# EAGLE design syma-wireless-charger (EAGLE 7.5.0)
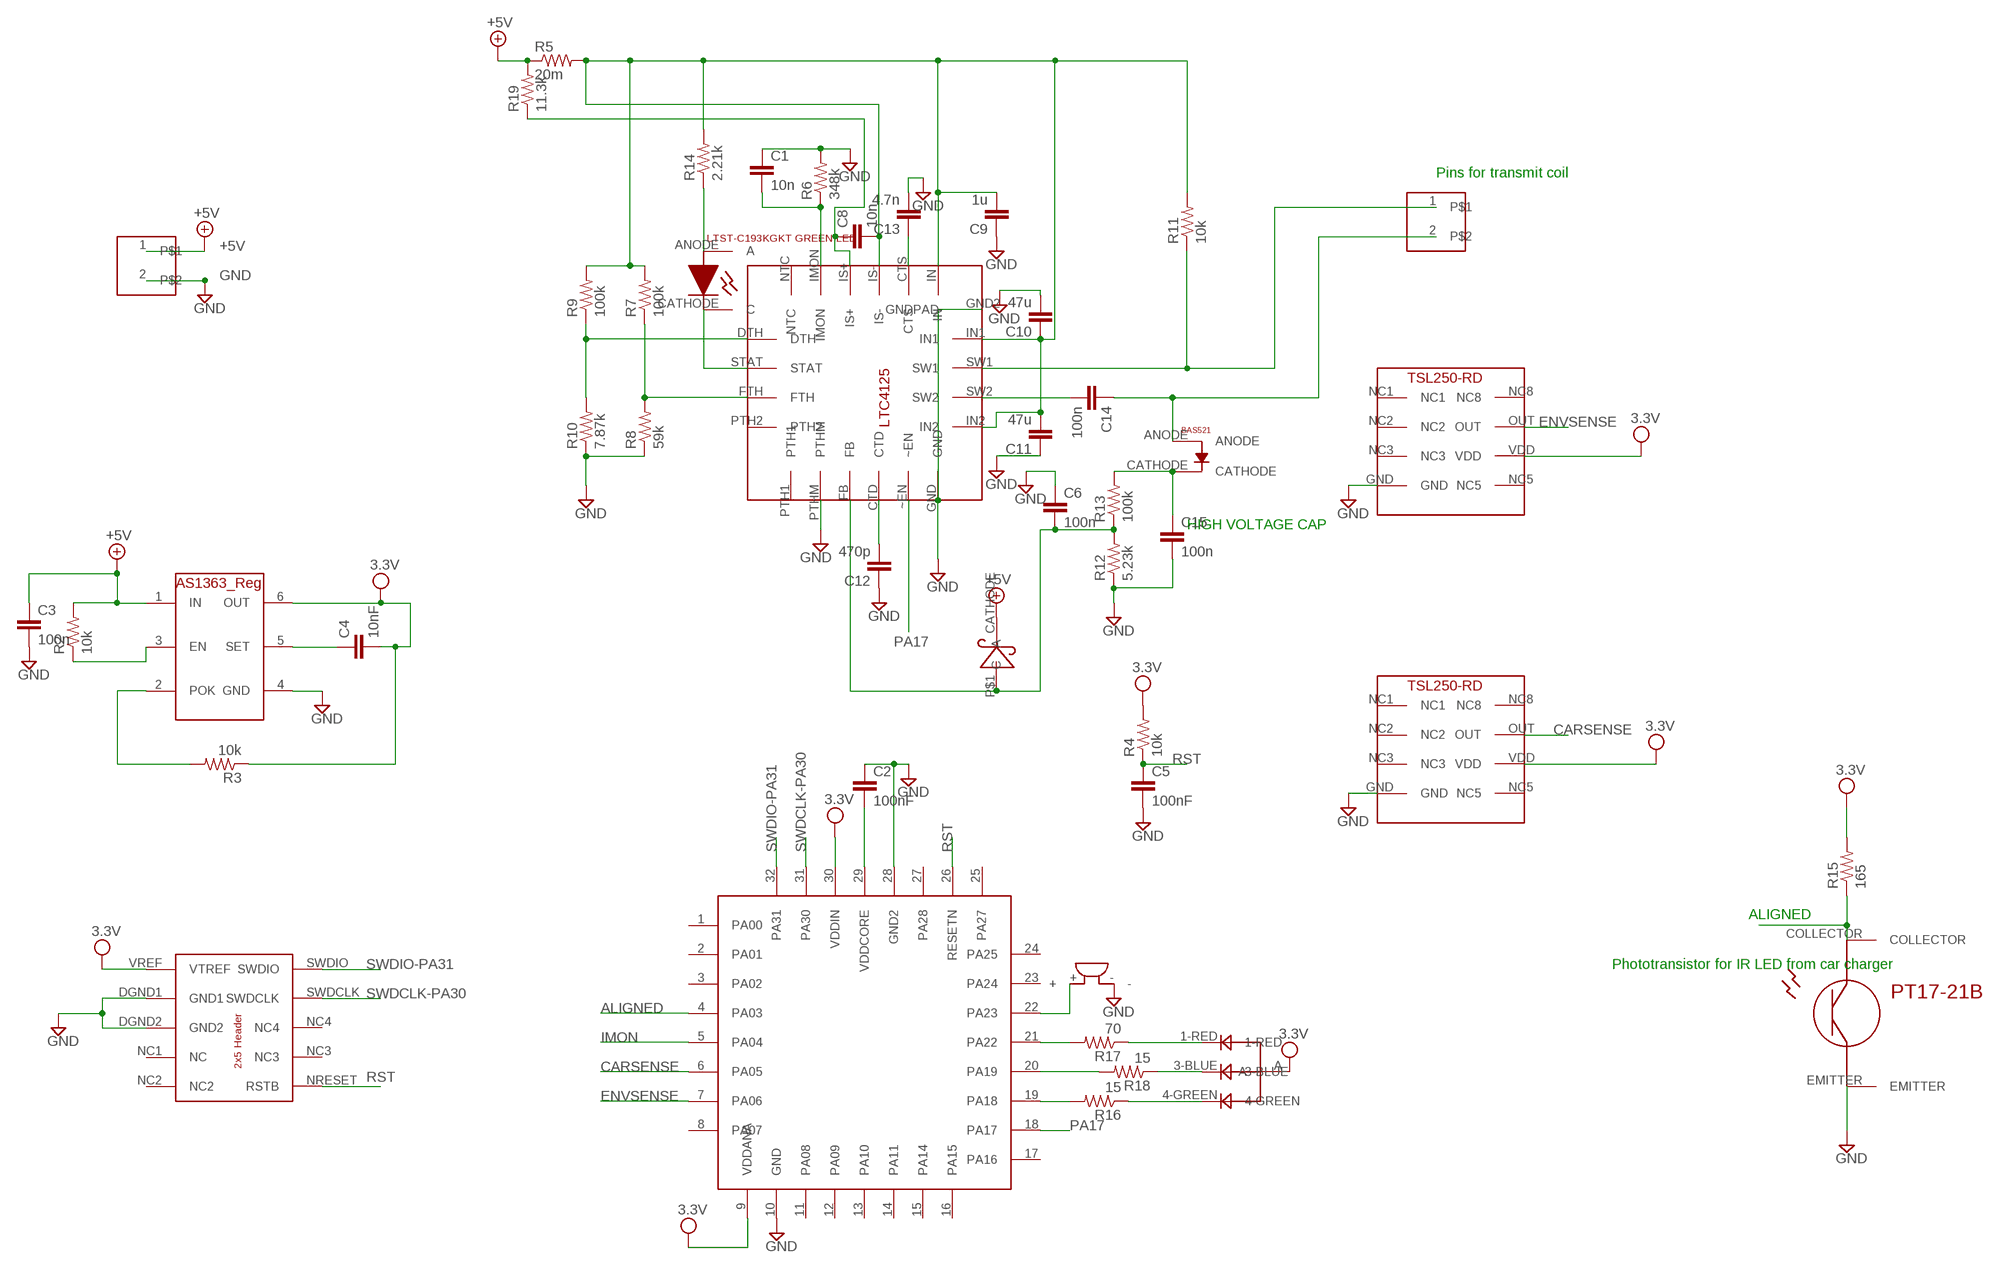
[diagram p0: schematic, sheet 1]

## Parts
C1  10n  C-EUC0805  [C0805]
C2  100nF  C-EUC0805K  [C0805K]
C3  100n  C-EUC0805K  [C0805K]
C4  10nF  C-EUC0805K  [C0805K]
C5  100nF  C-EUC0805K  [C0805K]
C6  100n  C-EUC0805  [C0805]
C8  10n  C-EUC0805  [C0805]
C9  1u  C-EUC0805  [C0805]
C10  47u  C-EUC0805  [C0805]
C11  47u  C-EUC0805  [C0805]
C12  470p  C-EUC0805  [C0805]
C13  4.7n  C-EUC0805  [C0805]
C14  100n  C-EUC1206  [C1206]
C15  100n  C-EUC0603  [C0603]
DBG1  DEBUGHEAD  [DEBUGHEAD]
R2  10k  R-US_R0805  [R0805]
R3  10k  R-US_R0805  [R0805]
R4  10k  R-US_R0805  [R0805]
R5  20m  R-US_R0805  [R0805]
R6  348k  R-US_R0805  [R0805]
R7  100k  R-US_R0805  [R0805]
R8  59k  R-US_R0805  [R0805]
R9  100k  R-US_R0805  [R0805]
R10  7.87k  R-US_R0805  [R0805]
R11  10k  R-US_R0805  [R0805]
R12  5.23k  R-US_R0805  [R0805]
R13  100k  R-US_R0805  [R0805]
R14  2.21k  R-US_R0805  [R0805]
R15  165  R-US_R0805  [R0805]
R16  15  R-US_R0805  [R0805]
R17  70  R-US_R0805  [R0805]
R18  15  R-US_R0805  [R0805]
R19  11.3k  R-US_R0805  [R0805]
U1  SAMD21E  [TQFP32-08]
U2  3.3V_AS1363  [SOT23-6]
U$1  LTC4125  [LTC1945-QFN]
U$2  BAS521  [BAS521-V-DIODE]
U$3  1X02  [1X02]
U$4  RGBLED  [RGBLED]
U$5  BUZZER  [BUZZER]
U$6  TSL250-RD  [TSL250-RD]
U$7  TSL250-RD  [TSL250-RD]
U$8  SCHTKYDIODE-523  [SOD-523]
U$9  LTST-C193KGKT_GREEN-LED  [LTST-C193KGKT_GREEN-LED]
U$10  PT17-21B_PHOTOTRANSISTOR  [PT17-21B_PHOTOTRANSISTOR]
U$11  1X02  [1X02]

## Nets
+5V: C3.1 R2.2 R5.1 R19.2 U2.1(IN) U$3.1 U$8.CATHODE(C)
ALIGNED: R15.1 U1.4(PA03) U$10.COLLECTOR
CARSENSE: U1.6(PA05) U$6.OUT
ENVSENSE: U1.7(PA06) U$7.OUT
GND: C1.1 C2.1 C3.2 C5.2 C6.1 C9.1 C10.2 C11.1 C12.1 C13.2 C15.2 DBG1.DGND1(GND1) DBG1.DGND2(GND2) R6.2 R8.1 R10.1 R12.1 U1.10(GND) U1.28(GND2) U2.4(GND) U$1.GND U$1.GND2(GNDPAD) U$1.PTHM U$3.2 U$5.- U$6.GND U$7.GND U$10.EMITTER
IMON: C1.2 R6.1 U1.5(PA04) U$1.IMON
N$1: C2.2 U1.29(VDDCORE)
N$2: R3.2 U2.2(POK)
N$3: R2.1 U2.3(EN)
N$4: R9.1 R10.2 U$1.DTH
N$5: C4.1 U2.5(SET)
N$6: R7.1 R8.2 U$1.FTH
N$7: R11.1 U$1.SW1 U$11.1
N$9: C6.2 R12.2 R13.1 U$1.FB U$8.P$1(A)
N$10: C15.1 R13.2 U$2.CATHODE
N$11: R14.1 U$9.ANODE(A)
N$12: C14.1 U$2.ANODE U$11.2
N$13: R17.2 U1.21(PA22)
N$14: R18.2 U1.20(PA19)
N$15: R16.2 U1.19(PA18)
N$16: R16.1 U$4.4-GREEN
N$17: R18.1 U$4.3-BLUE
N$18: R17.1 U$4.1-RED
N$19: U1.22(PA23) U$5.+
N$20: C8.2 C9.2 C10.1 C11.2 R5.2 R7.2 R9.2 R11.2 R14.2 U$1.IN U$1.IN1 U$1.IN2 U$1.IS-
N$21: C8.1 R19.1 U$1.IS+
N$22: C14.2 U$1.SW2
N$23: U$1.STAT U$9.CATHODE(C)
N$24: C12.2 U$1.CTD
N$25: C13.1 U$1.CTS
PA17: U1.18(PA17) U$1.~EN
RST: C5.1 DBG1.NRESET(RSTB) R4.1 U1.26(RESETN)
SWDCLK-PA30: DBG1.SWDCLK U1.31(PA30)
SWDIO-PA31: DBG1.SWDIO U1.32(PA31)
VDD: C4.2 DBG1.VREF(VTREF) R3.1 R4.2 R15.2 U1.9(VDDANA) U1.30(VDDIN) U2.6(OUT) U$4.A U$6.VDD U$7.VDD ; supply symbol labelled 3.3V
Unconnected: DBG1.NC1(NC) DBG1.NC2 DBG1.NC3 DBG1.NC4 U1.1(PA00) U1.2(PA01) U1.3(PA02) U1.8(PA07) U1.11(PA08) U1.12(PA09) U1.13(PA10) U1.14(PA11) U1.15(PA14) U1.16(PA15) U1.17(PA16) U1.23(PA24) U1.24(PA25) U1.25(PA27) U1.27(PA28) U$1.NTC U$1.PTH1 U$1.PTH2 U$6.NC1 U$6.NC2 U$6.NC3 U$6.NC5 U$6.NC8 U$7.NC1 U$7.NC2 U$7.NC3 U$7.NC5 U$7.NC8

## Notes on the sheet
- Pins for transmit coil
- HIGH VOLTAGE CAP
- ALIGNED
- Phototransistor for IR LED from car charger

## Library data of the parts
C1 C6 C8-C14 = rcl:C-EU: CAPACITOR, European symbol
C2-C5 C15 = resistor:C-EU: CAPACITOR, European symbol
DBG1 = foe-scale:DEBUGHEAD
R2-R4 R15-R18 = resistor:R-US_: RESISTOR, American symbol
R5-R14 R19 = rcl:R-US_: RESISTOR, American symbol
U1 = foe-scale:SAMD21E
U2 = foe-scale:3.3V_AS1363
U$1 = foe-scale:LTC4125
U$2 = foe-scale:BAS521
U$3 U$11 = foe-scale:1X02
U$4 = foe-scale:RGBLED
U$5 = foe-scale:BUZZER
U$6 U$7 = foe-scale:TSL250-RD
U$8 = foe-scale:SCHTKYDIODE-523
U$9 = foe-scale:LTST-C193KGKT_GREEN-LED
U$10 = foe-scale:PT17-21B_PHOTOTRANSISTOR

## Board
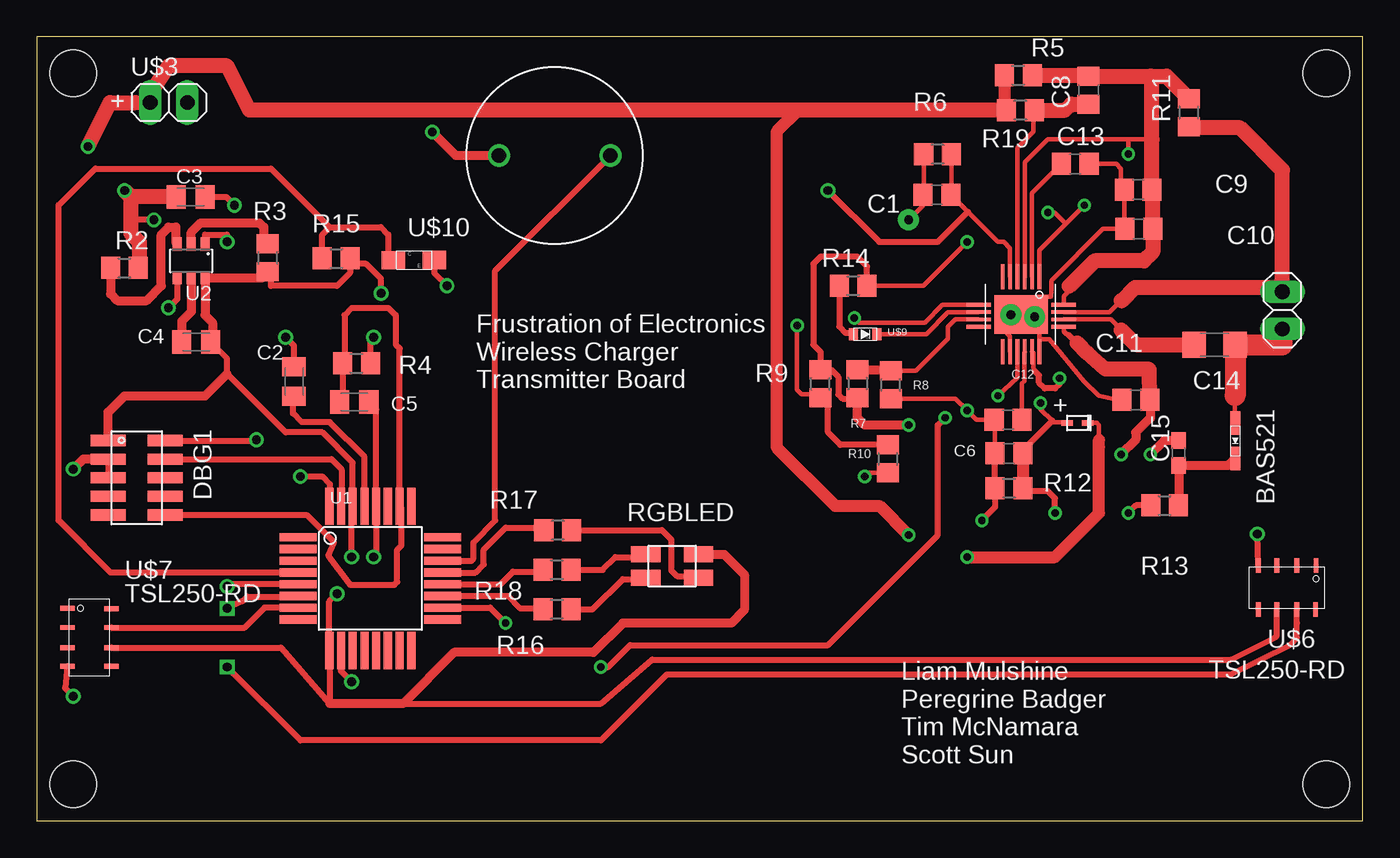
[diagram p1: board, top side]
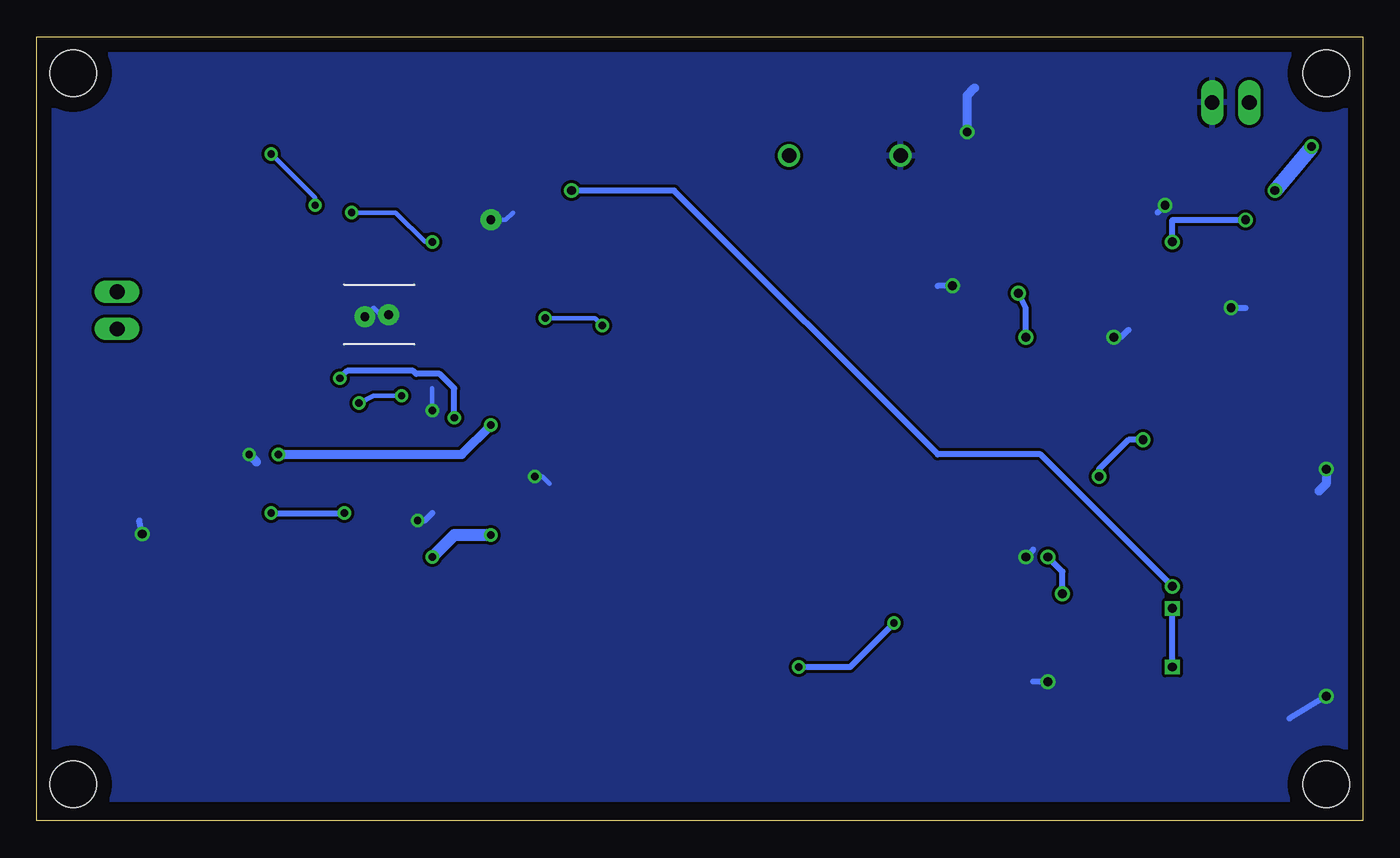
[diagram p2: board, bottom side, seen from below]

Size 90.5 x 53.5 mm. Coordinates in mm from the lower left corner, seen from the top.
Outline: 0,0 90.5,0 90.5,53.5 0,53.5 0,0
Copper layers (1*16): Top 0.035mm / dielectric 1.5mm / Bottom 0.035mm
Design rules "default": minimum track width 10mil, minimum drill 24mil, track to track 8mil, track to pad 8mil, pad to pad 8mil, via to via 8mil, smd to smd 8mil, copper to edge 40mil, drill to drill 8mil, minimum pad ring 10mil, minimum via ring 8mil, stop-mask expansion 4mil, vias tented up to drill 0mil, thermal gap 10mil
Holes 3.2 mm at 88,51 88,2.5 2.5,2.5 2.5,51

### Footprints (pad centres in the part's own frame; a part is rotated, then mirrored left to right if it is on the bottom)
C0805 = smd 1.3 x 1.5: 1 -0.95,0; 2 0.95,0
C0805K = smd 1.3 x 1.6: 1 -1,0; 2 1,0
C1206 = smd 1.6 x 1.8: 1 -1.4,0; 2 1.4,0
C0603 = smd 1.1 x 1: 1 -0.85,0; 2 0.85,0
DEBUGHEAD = smd 0.76 x 2.4: DGND1 1.27,-3.9; DGND2 2.54,-3.9; NC1 3.81,-3.9; NC2 5.08,-3.9; NC3 3.81,0; NC4 2.54,0; NRESET 5.08,0; SWDCLK 1.27,0; SWDIO 0,0; VREF 0,-3.9
R0805 = smd 1.3 x 1.5: 1 -0.95,0; 2 0.95,0
TQFP32-08 = smd 2.54 x 0.559: 1 -4.928,2.8; 2 -4.928,2; 3 -4.928,1.2; 4 -4.928,0.4; 5 -4.928,-0.4; 6 -4.928,-1.2; 7 -4.928,-2; 8 -4.928,-2.8; 17 4.928,-2.8; 18 4.928,-2; 19 4.928,-1.2; 20 4.928,-0.4; 21 4.928,0.4; 22 4.928,1.2; 23 4.928,2; 24 4.928,2.8 | smd 0.559 x 2.54: 9 -2.8,-4.928; 10 -2,-4.928; 11 -1.2,-4.928; 12 -0.4,-4.928; 13 0.4,-4.928; 14 1.2,-4.928; 15 2,-4.928; 16 2.8,-4.928; 25 2.8,4.928; 26 2,4.928; 27 1.2,4.928; 28 0.4,4.928; 29 -0.4,4.928; 30 -1.2,4.928; 31 -2,4.928; 32 -2.8,4.928
SOT23-6 = smd 0.6 x 0.9: 1 -0.95,-1.15; 2 0,-1.15; 3 0.95,-1.15; 4 0.95,1.15; 5 0,1.15; 6 -0.95,1.15
LTC1945-QFN = smd 0.25 x 1.7: CTD 1,4.6; CTS 0.5,-0.5; FB 1.5,4.6; GND 0,4.6; IMON 2,-0.5; IN 0,-0.5; IS+ 1.5,-0.5; IS- 1,-0.5; NTC 2.5,-0.5; PTH1 2.5,4.6; PTHM 2,4.6; ~EN 0.5,4.6 | smd 1.7 x 0.25: DTH 4.15,1.4; FTH 4.15,2.4; IN1 -1.65,1.4; IN2 -1.65,2.9; PTH2 4.15,2.9; STAT 4.15,1.9; SW1 -1.65,1.9; SW2 -1.65,2.4 | smd 3.65 x 2.65: GND2 1.249,2.059
BAS521-V-DIODE = smd 1.6 x 0.7: ANODE -1.211,0; CATHODE 1.186,0
1X02 = drill 1.016 long: 1 -1.27,0; 2 1.27,0
RGBLED = smd 2 x 1.1: 1-RED 0,0; 3-BLUE 3.6,-1.6; 4-GREEN 3.6,0; A 0,-1.6
BUZZER = drill 1: + 0,7.6; - 0,0
TSL250-RD = smd 1 x 0.33: GND -1.5,-1.955; NC1 -1.5,1.995; NC2 -1.5,0.685; NC3 -1.5,-0.685; NC5 1.5,-1.955; NC8 1.5,1.955; OUT 1.5,0.685; VDD 1.5,-0.685
SOD-523 = smd 0.8 x 0.4: CATHODE 1.2,0; P$1 -0.2,0
LTST-C193KGKT_GREEN-LED = smd 0.6 x 0.8: ANODE -0.8,0; CATHODE 0.8,0
PT17-21B_PHOTOTRANSISTOR = smd 1.6 x 1.25: COLLECTOR -0.194,0.616; EMITTER 2.588,0.63

### Placement (x,y rotation side)
C1  61.43,42.72 0 top
C2  17.57,29.98 270 top
C3  10.51,42.57 0 top
C4  10.89,32.67 0 top
C5  21.67,28.57 0 top
C6  66.34,25.07 0 top
C8  71.78,49.85 90 top
C9  75.16,43.07 0 top
C10  75.21,40.38 180 top
C11  75.01,28.72 0 top
C12  66.29,27.37 0 top
C13  70.87,44.82 0 top
C14  80.38,32.48 180 top
C15  77.93,25.1 90 top
DBG1  8.78,25.95 270 top
R2  5.99,37.72 0 top
R3  15.78,38.41 90 top
R4  21.83,31.22 0 top
R5  66.99,50.87 0 top
R6  61.48,45.48 180 top
R7  56.02,29.83 270 top
R8  58.28,29.75 90 top
R9  53.48,29.82 90 top
R10  58.1,24.7 90 top
R11  78.63,48.31 90 top
R12  66.35,22.7 0 top
R13  76.97,21.52 0 top
R14  55.72,36.52 0 top
R15  20.44,38.37 0 top
R16  35.51,14.43 180 top
R17  35.56,19.83 180 top
R18  35.51,17.13 180 top
R19  67.13,48.48 180 top
U1  22.77,16.55 0 top
U2  10.55,38.2 180 top
U$1  68.43,36.61 180 top
U$2  81.8,25.92 270 top
U$3  9.02,49.01 0 top
U$4  45.17,16.58 180 top
U$5  31.55,45.39 270 top
U$6  85.31,15.92 270 top
U$7  3.6,12.51 0 top
U$8  70.52,27.15 0 top
U$9  56.54,33.2 0 top
U$10  24.55,37.63 0 top
U$11  85.01,34.83 270 top

### Tracks (layer width: path | path; a pad name or v marks a point on that pad's centre or on a via)
+5V  (via drill 0.5, 0.6)
  Top 0.305: U$8.CATHODE 72.35,27.15 72.5,27 72.5,25.5
  Top 0.406: U2.1 11.5,40 13,40 v13,39.5 | v8,41 6.43,41
  Top 0.813: R5.1 66.04,48.62 R19.2 51.98,48.48 50.5,47 50.5,25.5 54.5,21.5 57.5,21.5 v59.5,19.5 | v63.5,18 69.5,18 72.5,21 72.5,25.5 72.5,26
  Top 1.016: C3.1 6.43,42.57 | 6.43,42.57 v6,43 | v3.5,46 5,49 6.74,49 U$3.1 7.5,49.26 9,51.5 13,51.5 14.52,48.48 R19.2 | 6.43,42.57 6.43,41 6.43,40.07 7,39.5 7,37.78 R2.2
  Bottom 0.406: v13,39.5 13,41 v8,41
  Bottom 0.813: v59.5,19.5 62,19.5 v63.5,18
  Bottom 1.016: v6,43 v3.5,46
ALIGNED
  Top 0.406: R15.1 19.49,39.99 20,40.5 | 20,40.5 23.5,40.5 24,40 24,38.6 U$10.COLLECTOR | U1.4 5.05,16.95 1.5,20.5 1.5,42 4,44.5 16,44.5 20,40.5
CARSENSE  (via drill 0.6)
  Top 0.406: v13,10.5 18,5.5 38.5,5.5 43.01,10.01 81.5,10 85.5,12 86,12.5 86,13.5 86,13.51 U$6.OUT | v13,14.5 14,15 14.07,15 14.37,15.3 17.8,15.3 U1.6
  Bottom 0.406: v13,10.5 v13,14.5
ENVSENSE
  Top 0.406: U1.7 15.55,14.55 14.2,13.2 U$7.OUT
GND  (via drill 0.5, 0.6, 0.6 pad 1.42)
  Top 0.305: U$1.GND2 66.55,34.55 v66.49,34.52 66,34 66,33.5 66.43,33.07 U$1.PTHM | v59.5,41 60.48,41.98 C1.1 60.53,42.77 R6.2 | U$1.GND 68.43,33.02 | 68.43,33.02 68.43,33.57 68.1,34.1 v68.1,34.4 68,35.5 68.14,35.74 69.2,35.74 69.23,36.17 69.23,36.86 72.76,40.38 C10.2 74.21,40.43 C9.1 74,43.28 74,44.5 73.68,44.82 C13.2 | C6.1 65.39,27.32 C12.1 64.13,27.37 v63.5,28 62.7,28.8 R8.1 | R10.1 56.75,23.75 v56.5,23.5 | C11.1 73.72,28.72 72.5,29 71.47,30 69.09,32.88 68.57,32.88 68.43,33.02
  Top 0.406: C5.2 23.17,28.07 U1.28 23.17,18.17 v23,18 | U1.10 20.77,10.23 v21.5,9.5 | U$7.GND 1.95,9.05 v2.5,8.5 | 31.5,45.34 U$5.- | C2.1 17.57,32.43 v17,33 | U2.4 9.6,35.6 v9,35 | C3.2 12.93,42.57 v13.5,42 | U$10.EMITTER 27.14,37.36 v28,36.5 | DBG1.DGND1 DBG1.DGND2 | C6.1 R12.1 65.4,21.4 v64.5,20.5 | U$6.GND v83.3,19.58
  Top 0.61: DBG1.DGND1 3.18,24.68 v2.5,24 | U$5.- 28.61,45.39 v27,47 | C15.2 76.95,25.95 v76,25
  Bottom 0.305: v66.49,34.52 67,34.5 67.5,35 v68.1,34.4 | v59.5,41 58.5,41 58,41.5 | v63.5,28 63.5,29.5 | v56.5,23.5 56,23.5 55.5,23
  Bottom 0.406: v23,18 22.5,18.5 | v21.5,9.5 22.5,9.5 | v2.5,8.5 5,7 | v17,33 16.5,33 16,33.5 | v9,35 8,35 | v13.5,42 14,41.5 | v28,36.5 29,36.5 | v64.5,20.5 64,20.5 63.5,21 | v83.3,19.58 83.5,20.5
  Bottom 0.61: v2.5,24 2.5,23 3,22.5 | v27,47 27,49.5 26.5,50 | v76,25 75.5,24.5
  pour Bottom: 0,53.5 90.5,53.5 90.5,1.5 0,1.5
IMON  (via drill 0.6)
  Top 0.305: R6.1 62.43,42.77 C1.2 63.55,41.55 65.6,39.5 66,39.5 66.43,39.07 U$1.IMON
  Top 0.406: U1.5 13,16.15 v13,16 | v54,43 57.5,39.5 61.5,39.5 63.55,41.55
  Bottom 0.406: v13,16 22,25 29,25 47,43 v54,43
N$1
  Top 0.406: U1.29 22.37,24.83 20,27.2 18.1,27.2 17.5,27.8 17.5,28.91 C2.2
N$2
  Top 0.61: U2.2 10.55,40.15 11.2,40.8 15.2,40.8 15.5,40.5 15.5,39.64 R3.2
N$3
  Top 0.61: R2.1 5.04,35.96 5.5,35.5 7.5,35.5 8.5,36.5 8.5,40 9,40.5 9.5,40.5 9.5,39.45 U2.3
N$4  (via drill 0.5)
  Top 0.305: U$1.DTH 61.81,35.21 60.6,34 56.1,34 v55.8,34.3 | v51.9,33.8 51.9,29.4 52.2,29.1 53.25,29.1 R9.1
  Top 0.406: R10.2 54.85,25.65 54,26.5 54,28.35 R9.1
  Bottom 0.305: v55.8,34.3 52.4,34.3 v51.9,33.8
N$5
  Top 0.61: U2.5 10.55,34.75 9.9,34.1 C4.1
N$6
  Top 0.305: U$1.FTH 62.71,34.21 62.2,33.7 62.2,32.9 60,30.7 R8.2
  Top 0.61: R7.1 58.2,30.78 R8.2
N$7
  Top 0.305: U$1.SW1 73.21,34.71 74,35.5
  Top 1.016: 74,35.5 74.07,35.5 74.97,36.4 84.71,36.4 U$11.1 85.01,44.4 82.14,47.27 78.72,47.27 R11.1
N$9  (via drill 0.5)
  Top 0.305: U$1.FB 66.93,30.23 v65.6,29 | v68.5,28.5 68.5,28.1 69.3,27.3 69.4,27.2 70.27,27.2 U$8.P$1
  Top 0.406: C6.2 67.29,25.29 69.3,27.3 | R13.1 75.02,21.52 v74.5,21 | v69.5,21 69.5,22 69,22.5 67.5,22.5 R12.2
  Top 0.813: C6.2 R12.2
  Bottom 0.305: v65.6,29 67.5,29 v68.5,28.5
  Bottom 0.406: v74.5,21 v69.5,21
N$10
  Top 0.61: R13.2 C15.1 81.32,24.25 U$2.CATHODE
N$11
  Top 0.406: R14.1 54.77,33.73 55.2,33.3 55.65,33.3 U$9.ANODE
N$12
  Top 0.305: 81.78,29.01 81.78,27.16 U$2.ANODE
  Top 1.422: U$11.2 85,32.5 84.98,32.48 C14.1 81.78,29.02 81.78,29.01
N$13
  Top 0.406: U1.21 29.95,16.95 30.5,17.5 30.5,18.5 32,20 34.44,20 R17.2
N$14
  Top 0.406: U1.20 31.65,16.15 32.5,17 34.43,17 R18.2
N$15
  Top 0.406: U1.19 32.15,15.35 33,14.5 34.49,14.5 R16.2
N$16
  Top 0.406: R16.1 37.93,14.43 40,16.5 41.49,16.5 U$4.4-GREEN
N$17
  Top 0.406: R18.1 38.63,17.13 39.5,18 41.39,18 U$4.3-BLUE
N$18
  Top 0.406: R17.1 42.67,19.83 43.3,19.2 43.3,17.1 43.7,16.7 45.05,16.7 U$4.1-RED
N$19
  Top 0.406: U1.22 29.65,17.75 29.8,17.9 29.8,19 31.3,20.5 31.3,37.54 U$5.+
N$20  (via drill 0.5)
  Top 0.305: U$1.IN1 70.1,35.23 70.1,35.8 70.47,36.17 70.47,36.47 | 71.01,32.61 70.43,33.19 70.26,33.19 70.08,33.37 U$1.IN2 70.08,33.42 71.5,32 72,32 73,31 75.5,31 76,30.5 76,28.5 | U$1.IS- 67.43,44.93 69,46.5 74.5,46.5 | 74.5,46.5 76.11,46.5 | U$1.IN 68.43,38.93 70.25,40.75 | 70.25,40.75 v71.5,42 | v74.5,45.5 74.5,46.5 | R14.2 60.52,36.52 v63.5,39.5 | v69,41.5 69.5,41.5 70.25,40.75
  Top 0.406: R7.2 55.94,28.8 55,28.8 54.7,29.1 54.7,30.3 54.23,30.77 R9.2 53.5,30.79 53.5,32 53,32.5 53,38 53.5,38.5 56,38.5 56.67,37.83 R14.2
  Top 0.61: 76,28.5 76,27.5 75,26.5 75,26 v74,25 | v59.5,27 56.5,27 56,27.5 56,28.86 R7.2
  Top 1.016: R5.2 71.71,50.87 C8.2 76,50.8 | 76,50.8 77.09,50.8 R11.2 | C11.2 75.92,30.81 72.93,30.82 71.72,31.91 71.01,32.61 | 70.47,36.47 72.2,38.21 75.56,38.21 76.16,38.8 C10.1 76.16,43.02 C9.2 76.11,46.5 76.11,50.69 76,50.8
  Bottom 0.305: v71.5,42 71.5,42.5 v74.5,45.5 | v63.5,39.5 64,39.5 66,41.5 v69,41.5
  Bottom 0.61: v74,25 61.5,25 v59.5,27
N$21
  Top 0.305: U$1.IS+ 66.93,45.93 68,47 68,48.4 R19.1
  Top 1.016: R19.1 70.18,48.48 70.6,48.9 C8.1
N$22
  Top 0.305: U$1.SW2 73.29,34.21 74,33.5
  Top 1.016: 74,33.5 75,32.5 78.96,32.5 C14.2
N$23
  Top 0.305: U$9.CATHODE 60.7,33.2 62.2,34.7 U$1.STAT
N$24
  Top 0.305: C12.2 67.24,29.84 67.4,30 67.4,31.98 U$1.CTD
N$25
  Top 0.305: U$1.CTS 67.93,42.83 C13.1
PA17  (via drill 0.5)
  Top 0.305: 68.1,30.7 68.1,30.8 68,30.9 68,31.94 U$1.~EN
  Top 0.406: U1.18 30.95,14.55 v32,13.5 | v38.5,10.5 39,10.5 40.5,12 54,12 61.5,19.5 61.5,27 v62,27.5 | v69.8,30.2 69.8,29.8 69.5,29.5 68.8,29.5 68.4,29.9 68.4,30.4 68.1,30.7
  Bottom 0.406: v32,13.5 35,10.5 v38.5,10.5 | v62,27.5 62,29.5 63,30.5 64.6,30.5 64.8,30.7 69.3,30.7 v69.8,30.2
RST
  Top 0.406: C5.1 20.88,28.78 R4.1 21,31.34 21,34.5 21.5,35 24,35 24.5,34.5 24.5,32.5 24.77,32.23 U1.26 24.9,21.35 24.9,18.8 24.6,18.5 24.6,16.3 24.4,16.1 21.4,16.1 19.9,18.1 20.29,19 18.42,20.87 DBG1.NRESET
SWDCLK-PA30
  Top 0.406: DBG1.SWDCLK 20.12,24.68 20.8,24 20.8,21.5 U1.31
SWDIO-PA31  (via drill 0.6)
  Top 0.406: DBG1.SWDIO 14.95,25.95 v15,26 | v18,23.5 19.5,23.5 20,23 20,21.5 U1.32
  Bottom 0.406: v15,26 16,26 18,24 v18,23.5
VDD  (via drill 0.6)
  Top 0.406: C4.2 13,31.56 13,30.5 17,26.5 19.5,26.5 21.57,24.43 U1.30 21.5,21.4 v21.5,18 | R3.1 16,37.24 16,36.5 20.5,36.5 21.39,37.39 R15.2 21.76,38 22.5,38 23.5,37 v23.5,36 | R4.2 22.78,32.78 v23,33 | v20.5,15.5 19.97,14.97 U1.9 20,11.62 20,8 | 20,8 16.68,11.83 U$7.VDD | 20,8 38.5,8 42,11 81.5,11 84.5,12.5 84.62,12.62 U$6.VDD
  Top 0.61: C4.2 12,32.78 12,34 11.5,34.5 U2.6 15.37,37.05 R3.1 | DBG1.VREF 4.88,27.88 6,29 11.5,29 13,30.5 | U$4.A 46.92,18.18 48.3,16.8 48.3,14.4 47.4,13.5 40,13.5 38,11.5 28.5,11.5 25,8 20,8
  Bottom 0.406: v23,33 23,35 v23.5,36 | v20.5,15.5 20.5,17 v21.5,18

### Text on the board
tPlace: + | Frustration of Electronics / Wireless Charger / Transmitter Board | Liam Mulshine / Peregrine Badger / Tim McNamara / Scott Sun